# EAGLE schematic nest_interface_a (EAGLE 6.3)
ahh
REV: A; TITLE: Nest Interface Board

## Sheet 1 of 8
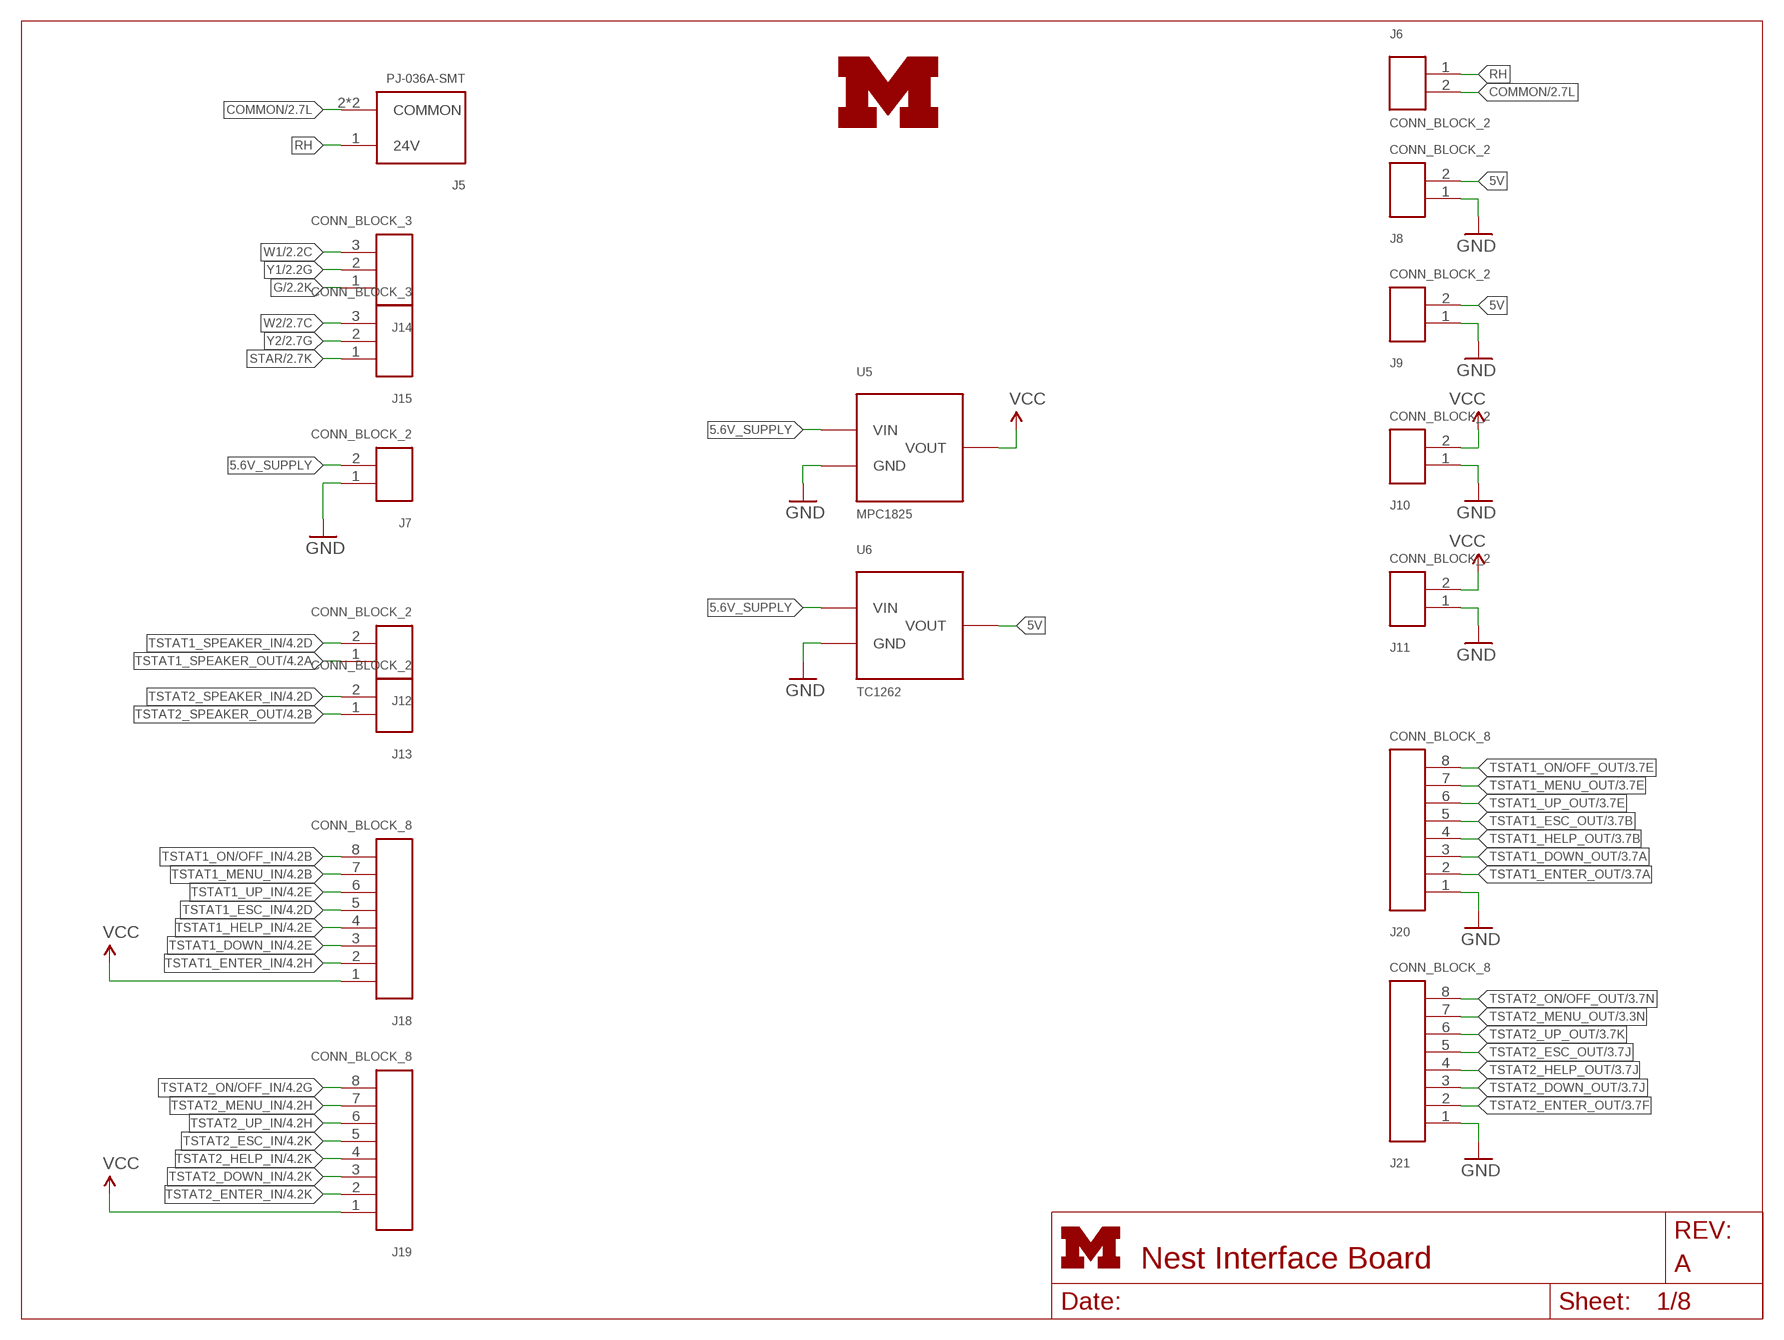
[diagram p0: schematic, sheet 1]

### Parts
J5  PJ-036A-SMT  [PJ-0361-SMT]
J6  CONN_BLOCK_2  [CONN_BLOCK_2]
J7  CONN_BLOCK_2  [CONN_BLOCK_2]
J8  CONN_BLOCK_2  [CONN_BLOCK_2]
J9  CONN_BLOCK_2  [CONN_BLOCK_2]
J10  CONN_BLOCK_2  [CONN_BLOCK_2]
J11  CONN_BLOCK_2  [CONN_BLOCK_2]
J12  CONN_BLOCK_2  [CONN_BLOCK_2]
J13  CONN_BLOCK_2  [CONN_BLOCK_2]
J14  CONN_BLOCK_3  [CONN_BLOCK_3]
J15  CONN_BLOCK_3  [CONN_BLOCK_3]
J18  CONN_BLOCK_8  [CONN_BLOCK_8]
J19  CONN_BLOCK_8  [CONN_BLOCK_8]
J20  CONN_BLOCK_8  [CONN_BLOCK_8]
J21  CONN_BLOCK_8  [CONN_BLOCK_8]
U5  MPC1825  [SOT-223-3]
U6  TC1262  [SOT-223-3]
U$1  UMICH_SOLID_LARGE  [UMICH_SOLID_350MIL]

### Nets
5.6V_SUPPLY: J7.2 U5.1(VIN) U6.1(VIN)
5V: J8.2 J9.2 U6.3(VOUT)
COMMON: J5.2(COMMON) J5.3(COMMON) J6.2 ; also sheet 2
G: J14.1 ; also sheet 2
GND: J7.1 J8.1 J9.1 J10.1 J11.1 J20.1 J21.1 U5.2(GND) U5.4(GND) U6.2(GND) U6.4(GND) ; also sheet 2,3,4,5,6,7,8
RH: J5.1(24V) J6.1
STAR: J15.1 ; also sheet 2
TSTAT1_DOWN_IN: J18.3 ; also sheet 4,6
TSTAT1_DOWN_OUT: J20.3 ; also sheet 3
TSTAT1_ENTER_IN: J18.2 ; also sheet 4,6
TSTAT1_ENTER_OUT: J20.2 ; also sheet 3
TSTAT1_ESC_IN: J18.5 ; also sheet 4,6
TSTAT1_ESC_OUT: J20.5 ; also sheet 3
TSTAT1_HELP_IN: J18.4 ; also sheet 4,6
TSTAT1_HELP_OUT: J20.4 ; also sheet 3
TSTAT1_MENU_IN: J18.7 ; also sheet 4,6
TSTAT1_MENU_OUT: J20.7 ; also sheet 3
TSTAT1_ON/OFF_IN: J18.8 ; also sheet 4,6
TSTAT1_ON/OFF_OUT: J20.8 ; also sheet 3
TSTAT1_SPEAKER_IN: J12.2 ; also sheet 4
TSTAT1_SPEAKER_OUT: J12.1 ; also sheet 4
TSTAT1_UP_IN: J18.6 ; also sheet 4,6
TSTAT1_UP_OUT: J20.6 ; also sheet 3
TSTAT2_DOWN_IN: J19.3 ; also sheet 4,6
TSTAT2_DOWN_OUT: J21.3 ; also sheet 3
TSTAT2_ENTER_IN: J19.2 ; also sheet 4,6
TSTAT2_ENTER_OUT: J21.2 ; also sheet 3
TSTAT2_ESC_IN: J19.5 ; also sheet 4,6
TSTAT2_ESC_OUT: J21.5 ; also sheet 3
TSTAT2_HELP_IN: J19.4 ; also sheet 4,6
TSTAT2_HELP_OUT: J21.4 ; also sheet 3
TSTAT2_MENU_IN: J19.7 ; also sheet 4,6
TSTAT2_MENU_OUT: J21.7 ; also sheet 3
TSTAT2_ON/OFF_IN: J19.8 ; also sheet 4,6
TSTAT2_ON/OFF_OUT: J21.8 ; also sheet 3
TSTAT2_SPEAKER_IN: J13.2 ; also sheet 4
TSTAT2_SPEAKER_OUT: J13.1 ; also sheet 4
TSTAT2_UP_IN: J19.6 ; also sheet 4,6
TSTAT2_UP_OUT: J21.6 ; also sheet 3
VCC: J10.2 J11.2 J18.1 J19.1 U5.3(VOUT) ; also sheet 2,4,5,6,7
W1: J14.3 ; also sheet 2
W2: J15.3 ; also sheet 2
Y1: J14.2 ; also sheet 2
Y2: J15.2 ; also sheet 2

## Sheet 2 of 8: Relays
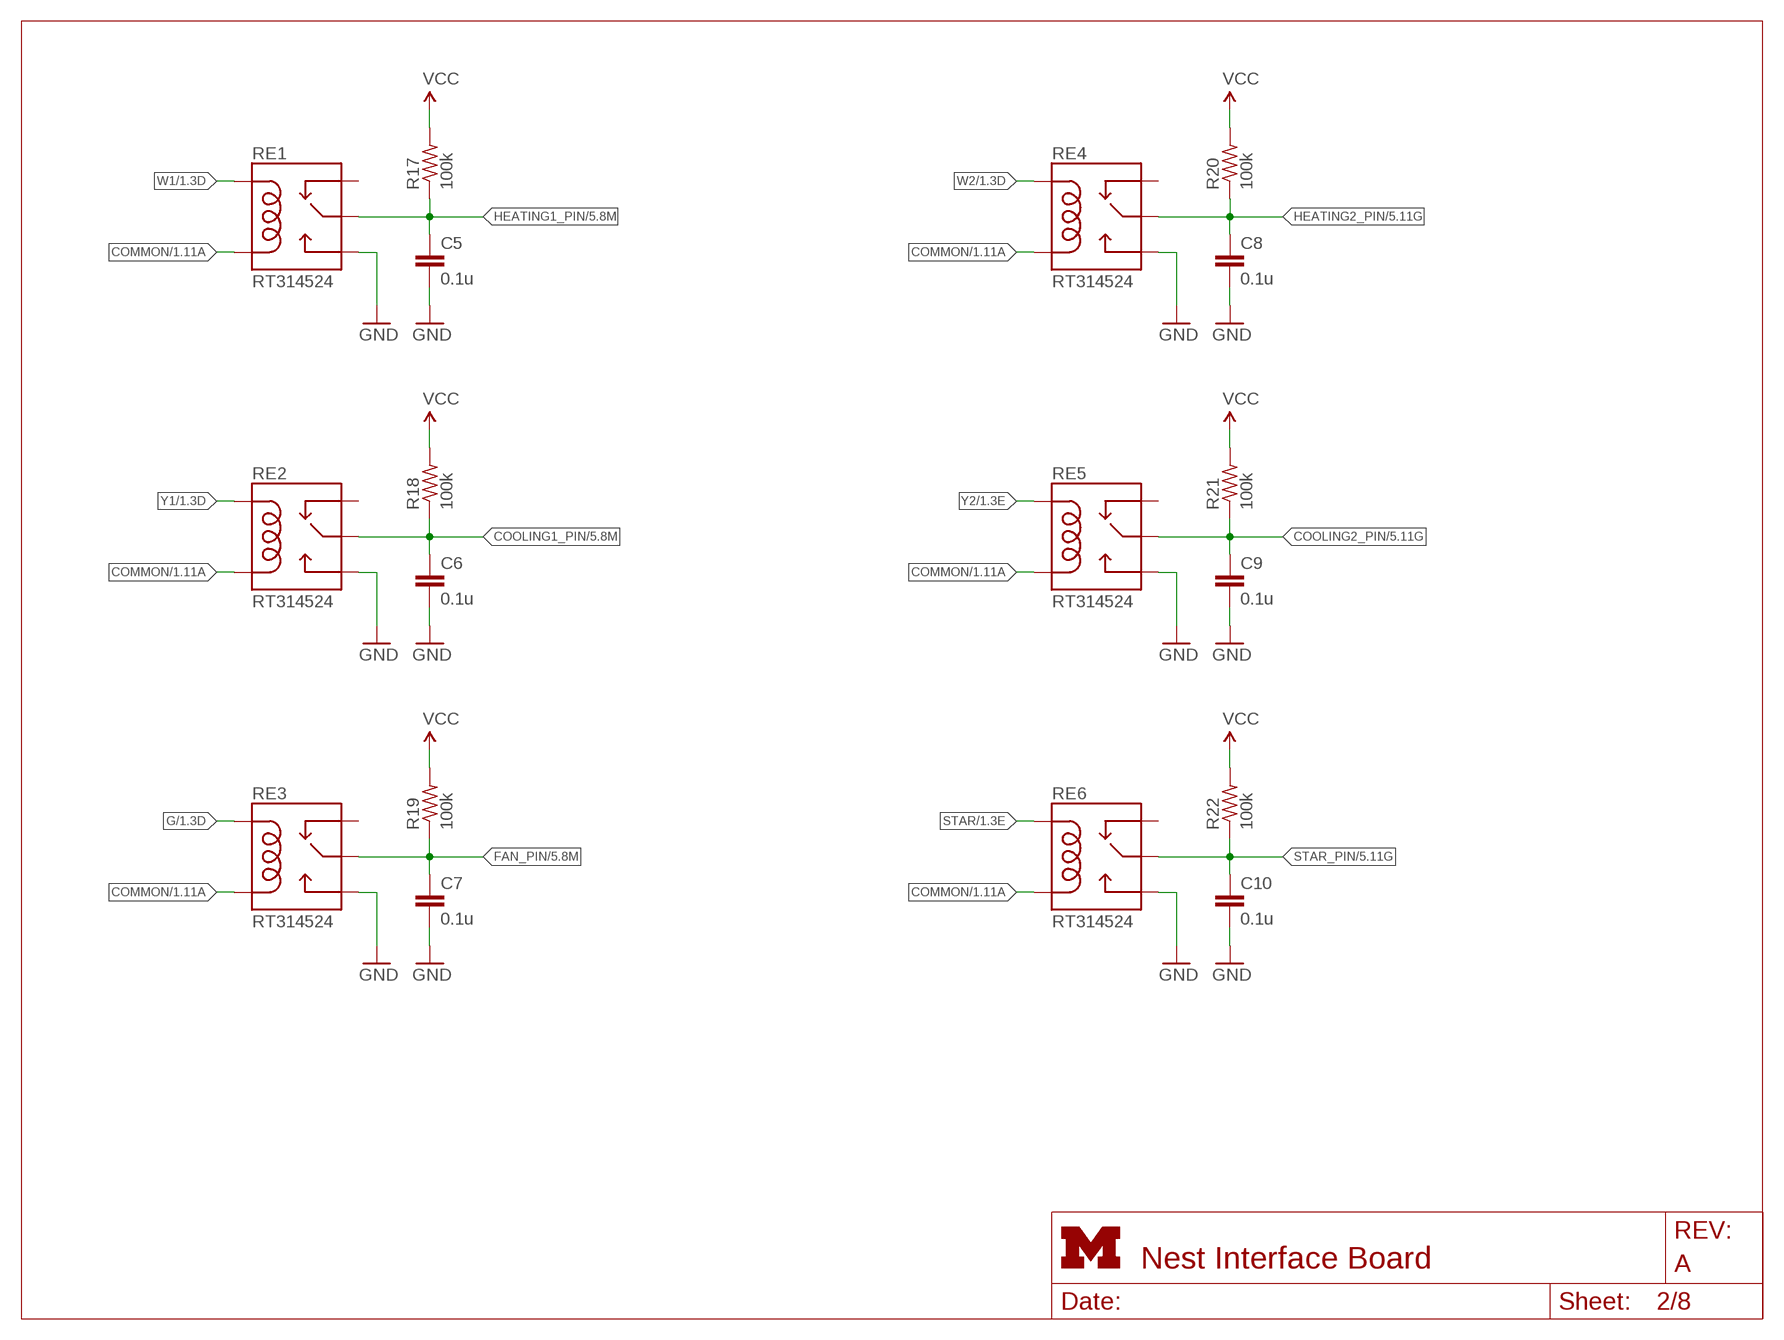
[diagram p1: schematic, sheet 2]

### Parts
C5  0.1u  C-EUC0603  [C0603]
C6  0.1u  C-EUC0603  [C0603]
C7  0.1u  C-EUC0603  [C0603]
C8  0.1u  C-EUC0603  [C0603]
C9  0.1u  C-EUC0603  [C0603]
C10  0.1u  C-EUC0603  [C0603]
R17  100k  R-US_R0603  [R0603]
R18  100k  R-US_R0603  [R0603]
R19  100k  R-US_R0603  [R0603]
R20  100k  R-US_R0603  [R0603]
R21  100k  R-US_R0603  [R0603]
R22  100k  R-US_R0603  [R0603]
RE1  RT314524  [S0418-CA]
RE2  RT314524  [S0418-CA]
RE3  RT314524  [S0418-CA]
RE4  RT314524  [S0418-CA]
RE5  RT314524  [S0418-CA]
RE6  RT314524  [S0418-CA]

### Nets
COMMON: RE1.A2(COIL2) RE2.A2(COIL2) RE3.A2(COIL2) RE4.A2(COIL2) RE5.A2(COIL2) RE6.A2(COIL2) ; also sheet 1
COOLING1_PIN: C6.1 R18.1 RE2.COMMON1(MAIN) RE2.COMMON2(MAIN) ; also sheet 5
COOLING2_PIN: C9.1 R21.1 RE5.COMMON1(MAIN) RE5.COMMON2(MAIN) ; also sheet 5
FAN_PIN: C7.1 R19.1 RE3.COMMON1(MAIN) RE3.COMMON2(MAIN) ; also sheet 5
G: RE3.A1(COIL1) ; also sheet 1
GND: C5.2 C6.2 C7.2 C8.2 C9.2 C10.2 RE1.NO1(NO) RE1.NO2(NO) RE2.NO1(NO) RE2.NO2(NO) RE3.NO1(NO) RE3.NO2(NO) RE4.NO1(NO) RE4.NO2(NO) RE5.NO1(NO) RE5.NO2(NO) RE6.NO1(NO) RE6.NO2(NO) ; also sheet 1,3,4,5,6,7,8
HEATING1_PIN: C5.1 R17.1 RE1.COMMON1(MAIN) RE1.COMMON2(MAIN) ; also sheet 5
HEATING2_PIN: C8.1 R20.1 RE4.COMMON1(MAIN) RE4.COMMON2(MAIN) ; also sheet 5
STAR: RE6.A1(COIL1) ; also sheet 1
STAR_PIN: C10.1 R22.1 RE6.COMMON1(MAIN) RE6.COMMON2(MAIN) ; also sheet 5
VCC: R17.2 R18.2 R19.2 R20.2 R21.2 R22.2 ; also sheet 1,4,5,6,7
W1: RE1.A1(COIL1) ; also sheet 1
W2: RE4.A1(COIL1) ; also sheet 1
Y1: RE2.A1(COIL1) ; also sheet 1
Y2: RE5.A1(COIL1) ; also sheet 1
Unconnected: RE1.NC1(NC) RE1.NC2(NC) RE2.NC1(NC) RE2.NC2(NC) RE3.NC1(NC) RE3.NC2(NC) RE4.NC1(NC) RE4.NC2(NC) RE5.NC1(NC) RE5.NC2(NC) RE6.NC1(NC) RE6.NC2(NC)

## Sheet 3 of 8: Wire interfacing
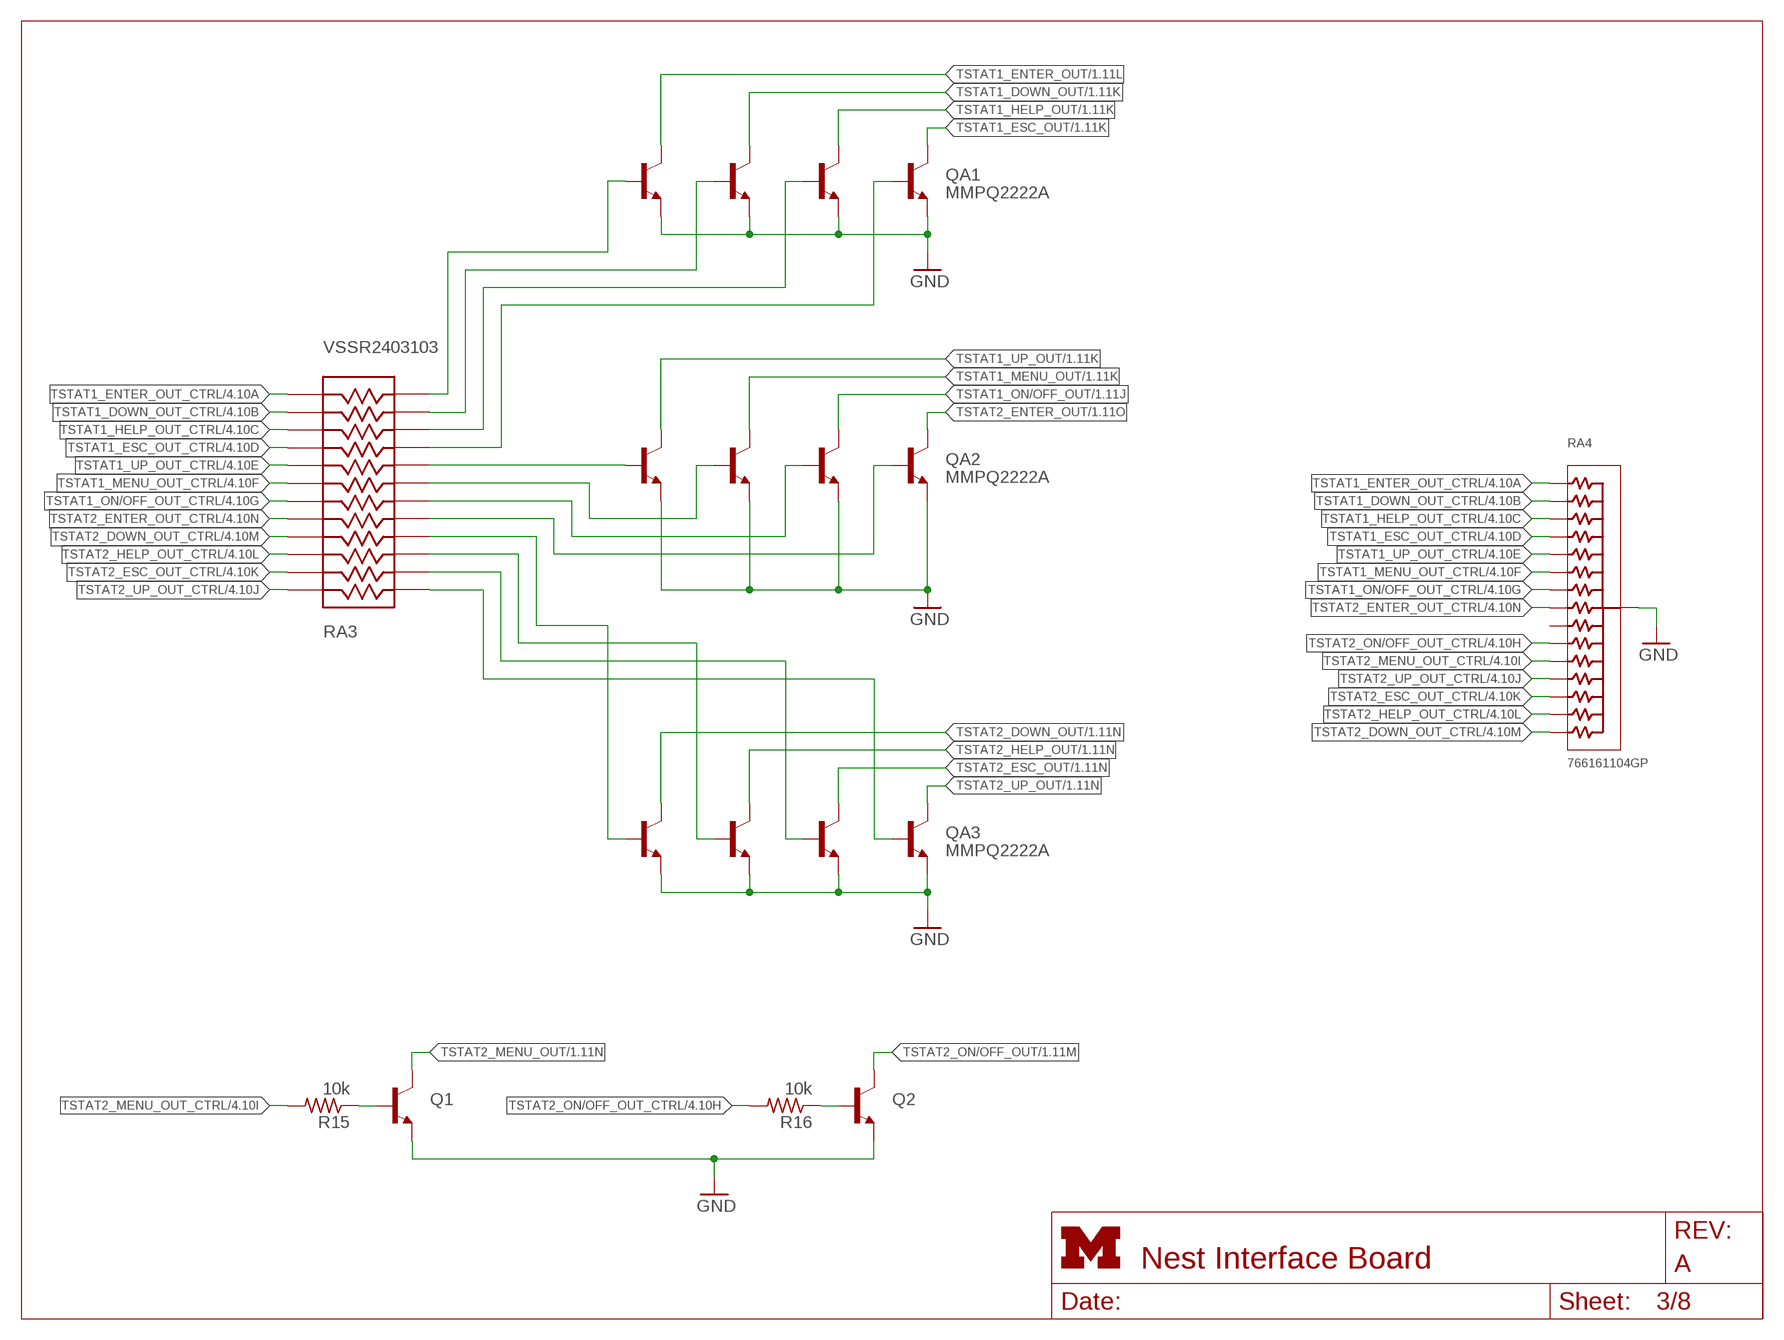
[diagram p2: schematic, sheet 3]

### Parts
Q1  TRANSISTOR_NPNSOT23  [SOT23]
Q2  TRANSISTOR_NPNSOT23  [SOT23]
QA1  MMPQ2222A  [SOIC-16]
QA2  MMPQ2222A  [SOIC-16]
QA3  MMPQ2222A  [SOIC-16]
R15  10k  R-US_R0603  [R0603]
R16  10k  R-US_R0603  [R0603]
RA3  VSSR2403103  [LSSOP-24]
RA4  766161104GP  [SOIC-16]

### Nets
GND: Q1.2(E) Q2.2(E) QA1.10(E4) QA1.12(E3) QA1.14(E2) QA1.16(E1) QA2.10(E4) QA2.12(E3) QA2.14(E2) QA2.16(E1) QA3.10(E4) QA3.12(E3) QA3.14(E2) QA3.16(E1) RA4.16(OUT) ; also sheet 1,2,4,5,6,7,8
N$16: QA2.11(B3) RA3.19
N$17: QA1.13(B2) RA3.14
N$25: QA1.11(B3) RA3.15
N$26: QA1.9(B4) RA3.16
N$27: QA3.9(B4) RA3.24
N$28: QA3.15(B1) RA3.21
N$29: QA3.13(B2) RA3.22
N$30: QA3.11(B3) RA3.23
N$31: Q1.1(B) R15.1
N$32: Q2.1(B) R16.1
N$33: QA1.15(B1) RA3.13
N$34: QA2.15(B1) RA3.17
N$37: QA2.9(B4) RA3.20
N$58: QA2.13(B2) RA3.18
TSTAT1_DOWN_OUT: QA1.3(C2) QA1.4(C2) ; also sheet 1
TSTAT1_DOWN_OUT_CTRL: RA3.11 RA4.2 ; also sheet 4
TSTAT1_ENTER_OUT: QA1.1(C1) QA1.2(C1) ; also sheet 1
TSTAT1_ENTER_OUT_CTRL: RA3.12 RA4.1 ; also sheet 4
TSTAT1_ESC_OUT: QA1.7(C4) QA1.8(C4) ; also sheet 1
TSTAT1_ESC_OUT_CTRL: RA3.9 RA4.4 ; also sheet 4
TSTAT1_HELP_OUT: QA1.5(C3) QA1.6(C3) ; also sheet 1
TSTAT1_HELP_OUT_CTRL: RA3.10 RA4.3 ; also sheet 4
TSTAT1_MENU_OUT: QA2.3(C2) QA2.4(C2) ; also sheet 1
TSTAT1_MENU_OUT_CTRL: RA3.7 RA4.6 ; also sheet 4
TSTAT1_ON/OFF_OUT: QA2.5(C3) QA2.6(C3) ; also sheet 1
TSTAT1_ON/OFF_OUT_CTRL: RA3.6 RA4.7 ; also sheet 4
TSTAT1_UP_OUT: QA2.1(C1) QA2.2(C1) ; also sheet 1
TSTAT1_UP_OUT_CTRL: RA3.8 RA4.5 ; also sheet 4
TSTAT2_DOWN_OUT: QA3.1(C1) QA3.2(C1) ; also sheet 1
TSTAT2_DOWN_OUT_CTRL: RA3.4 RA4.15 ; also sheet 4
TSTAT2_ENTER_OUT: QA2.7(C4) QA2.8(C4) ; also sheet 1
TSTAT2_ENTER_OUT_CTRL: RA3.5 RA4.8 ; also sheet 4
TSTAT2_ESC_OUT: QA3.5(C3) QA3.6(C3) ; also sheet 1
TSTAT2_ESC_OUT_CTRL: RA3.2 RA4.13 ; also sheet 4
TSTAT2_HELP_OUT: QA3.3(C2) QA3.4(C2) ; also sheet 1
TSTAT2_HELP_OUT_CTRL: RA3.3 RA4.14 ; also sheet 4
TSTAT2_MENU_OUT: Q1.3(C) ; also sheet 1
TSTAT2_MENU_OUT_CTRL: R15.2 RA4.11 ; also sheet 4
TSTAT2_ON/OFF_OUT: Q2.3(C) ; also sheet 1
TSTAT2_ON/OFF_OUT_CTRL: R16.2 RA4.10 ; also sheet 4
TSTAT2_UP_OUT: QA3.7(C4) QA3.8(C4) ; also sheet 1
TSTAT2_UP_OUT_CTRL: RA3.1 RA4.12 ; also sheet 4
Unconnected: RA4.9

## Sheet 4 of 8: Input buttons from thermostat
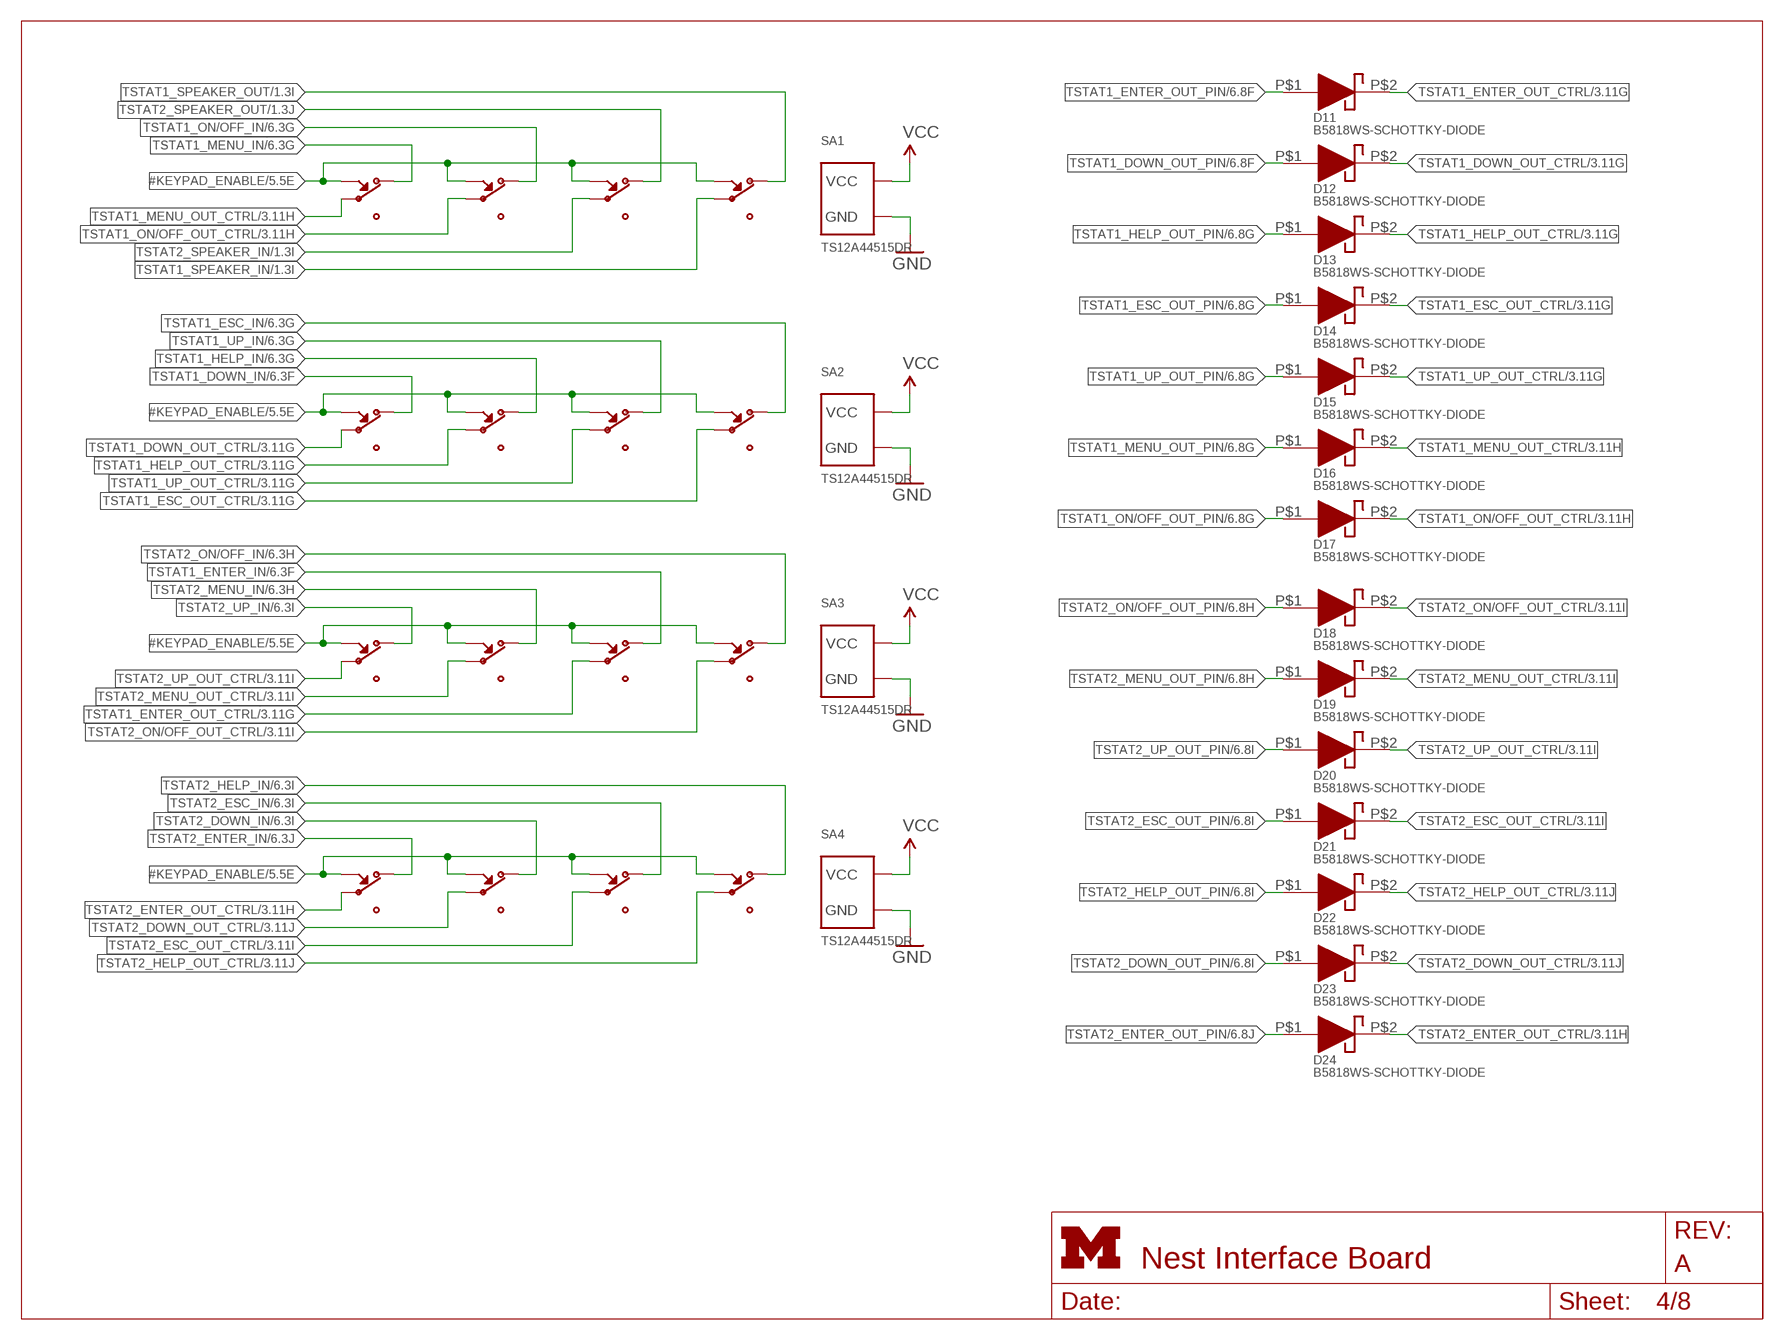
[diagram p3: schematic, sheet 4]

### Parts
D11  B5818WS-SCHOTTKY-DIODE  [SOD-323]
D12  B5818WS-SCHOTTKY-DIODE  [SOD-323]
D13  B5818WS-SCHOTTKY-DIODE  [SOD-323]
D14  B5818WS-SCHOTTKY-DIODE  [SOD-323]
D15  B5818WS-SCHOTTKY-DIODE  [SOD-323]
D16  B5818WS-SCHOTTKY-DIODE  [SOD-323]
D17  B5818WS-SCHOTTKY-DIODE  [SOD-323]
D18  B5818WS-SCHOTTKY-DIODE  [SOD-323]
D19  B5818WS-SCHOTTKY-DIODE  [SOD-323]
D20  B5818WS-SCHOTTKY-DIODE  [SOD-323]
D21  B5818WS-SCHOTTKY-DIODE  [SOD-323]
D22  B5818WS-SCHOTTKY-DIODE  [SOD-323]
D23  B5818WS-SCHOTTKY-DIODE  [SOD-323]
D24  B5818WS-SCHOTTKY-DIODE  [SOD-323]
SA1  TS12A44515DR  [SOIC-14]
SA2  TS12A44515DR  [SOIC-14]
SA3  TS12A44515DR  [SOIC-14]
SA4  TS12A44515DR  [SOIC-14]

### Nets
#KEYPAD_ENABLE: SA1.5(IN2) SA1.6(IN3) SA1.12(IN4) SA1.13(IN1) SA2.5(IN2) SA2.6(IN3) SA2.12(IN4) SA2.13(IN1) SA3.5(IN2) SA3.6(IN3) SA3.12(IN4) SA3.13(IN1) SA4.5(IN2) SA4.6(IN3) SA4.12(IN4) SA4.13(IN1) ; also sheet 5
GND: SA1.7(GND) SA2.7(GND) SA3.7(GND) SA4.7(GND) ; also sheet 1,2,3,5,6,7,8
TSTAT1_DOWN_IN: SA2.1(NC1) ; also sheet 1,6
TSTAT1_DOWN_OUT_CTRL: D12.P$2(C) SA2.2(COM1) ; also sheet 3
TSTAT1_DOWN_OUT_PIN: D12.P$1(A) ; also sheet 6
TSTAT1_ENTER_IN: SA3.8(NC3) ; also sheet 1,6
TSTAT1_ENTER_OUT_CTRL: D11.P$2(C) SA3.9(COM3) ; also sheet 3
TSTAT1_ENTER_OUT_PIN: D11.P$1(A) ; also sheet 6
TSTAT1_ESC_IN: SA2.11(NC4) ; also sheet 1,6
TSTAT1_ESC_OUT_CTRL: D14.P$2(C) SA2.10(COM4) ; also sheet 3
TSTAT1_ESC_OUT_PIN: D14.P$1(A) ; also sheet 6
TSTAT1_HELP_IN: SA2.3(NC2) ; also sheet 1,6
TSTAT1_HELP_OUT_CTRL: D13.P$2(C) SA2.4(COM2) ; also sheet 3
TSTAT1_HELP_OUT_PIN: D13.P$1(A) ; also sheet 6
TSTAT1_MENU_IN: SA1.1(NC1) ; also sheet 1,6
TSTAT1_MENU_OUT_CTRL: D16.P$2(C) SA1.2(COM1) ; also sheet 3
TSTAT1_MENU_OUT_PIN: D16.P$1(A) ; also sheet 6
TSTAT1_ON/OFF_IN: SA1.3(NC2) ; also sheet 1,6
TSTAT1_ON/OFF_OUT_CTRL: D17.P$2(C) SA1.4(COM2) ; also sheet 3
TSTAT1_ON/OFF_OUT_PIN: D17.P$1(A) ; also sheet 6
TSTAT1_SPEAKER_IN: SA1.10(COM4) ; also sheet 1
TSTAT1_SPEAKER_OUT: SA1.11(NC4) ; also sheet 1
TSTAT1_UP_IN: SA2.8(NC3) ; also sheet 1,6
TSTAT1_UP_OUT_CTRL: D15.P$2(C) SA2.9(COM3) ; also sheet 3
TSTAT1_UP_OUT_PIN: D15.P$1(A) ; also sheet 6
TSTAT2_DOWN_IN: SA4.3(NC2) ; also sheet 1,6
TSTAT2_DOWN_OUT_CTRL: D23.P$2(C) SA4.4(COM2) ; also sheet 3
TSTAT2_DOWN_OUT_PIN: D23.P$1(A) ; also sheet 6
TSTAT2_ENTER_IN: SA4.1(NC1) ; also sheet 1,6
TSTAT2_ENTER_OUT_CTRL: D24.P$2(C) SA4.2(COM1) ; also sheet 3
TSTAT2_ENTER_OUT_PIN: D24.P$1(A) ; also sheet 6
TSTAT2_ESC_IN: SA4.8(NC3) ; also sheet 1,6
TSTAT2_ESC_OUT_CTRL: D21.P$2(C) SA4.9(COM3) ; also sheet 3
TSTAT2_ESC_OUT_PIN: D21.P$1(A) ; also sheet 6
TSTAT2_HELP_IN: SA4.11(NC4) ; also sheet 1,6
TSTAT2_HELP_OUT_CTRL: D22.P$2(C) SA4.10(COM4) ; also sheet 3
TSTAT2_HELP_OUT_PIN: D22.P$1(A) ; also sheet 6
TSTAT2_MENU_IN: SA3.3(NC2) ; also sheet 1,6
TSTAT2_MENU_OUT_CTRL: D19.P$2(C) SA3.4(COM2) ; also sheet 3
TSTAT2_MENU_OUT_PIN: D19.P$1(A) ; also sheet 6
TSTAT2_ON/OFF_IN: SA3.11(NC4) ; also sheet 1,6
TSTAT2_ON/OFF_OUT_CTRL: D18.P$2(C) SA3.10(COM4) ; also sheet 3
TSTAT2_ON/OFF_OUT_PIN: D18.P$1(A) ; also sheet 6
TSTAT2_SPEAKER_IN: SA1.9(COM3) ; also sheet 1
TSTAT2_SPEAKER_OUT: SA1.8(NC3) ; also sheet 1
TSTAT2_UP_IN: SA3.1(NC1) ; also sheet 1,6
TSTAT2_UP_OUT_CTRL: D20.P$2(C) SA3.2(COM1) ; also sheet 3
TSTAT2_UP_OUT_PIN: D20.P$1(A) ; also sheet 6
VCC: SA1.14(VCC) SA2.14(VCC) SA3.14(VCC) SA4.14(VCC) ; also sheet 1,2,5,6,7

## Sheet 5 of 8: EPIC and programming circuit
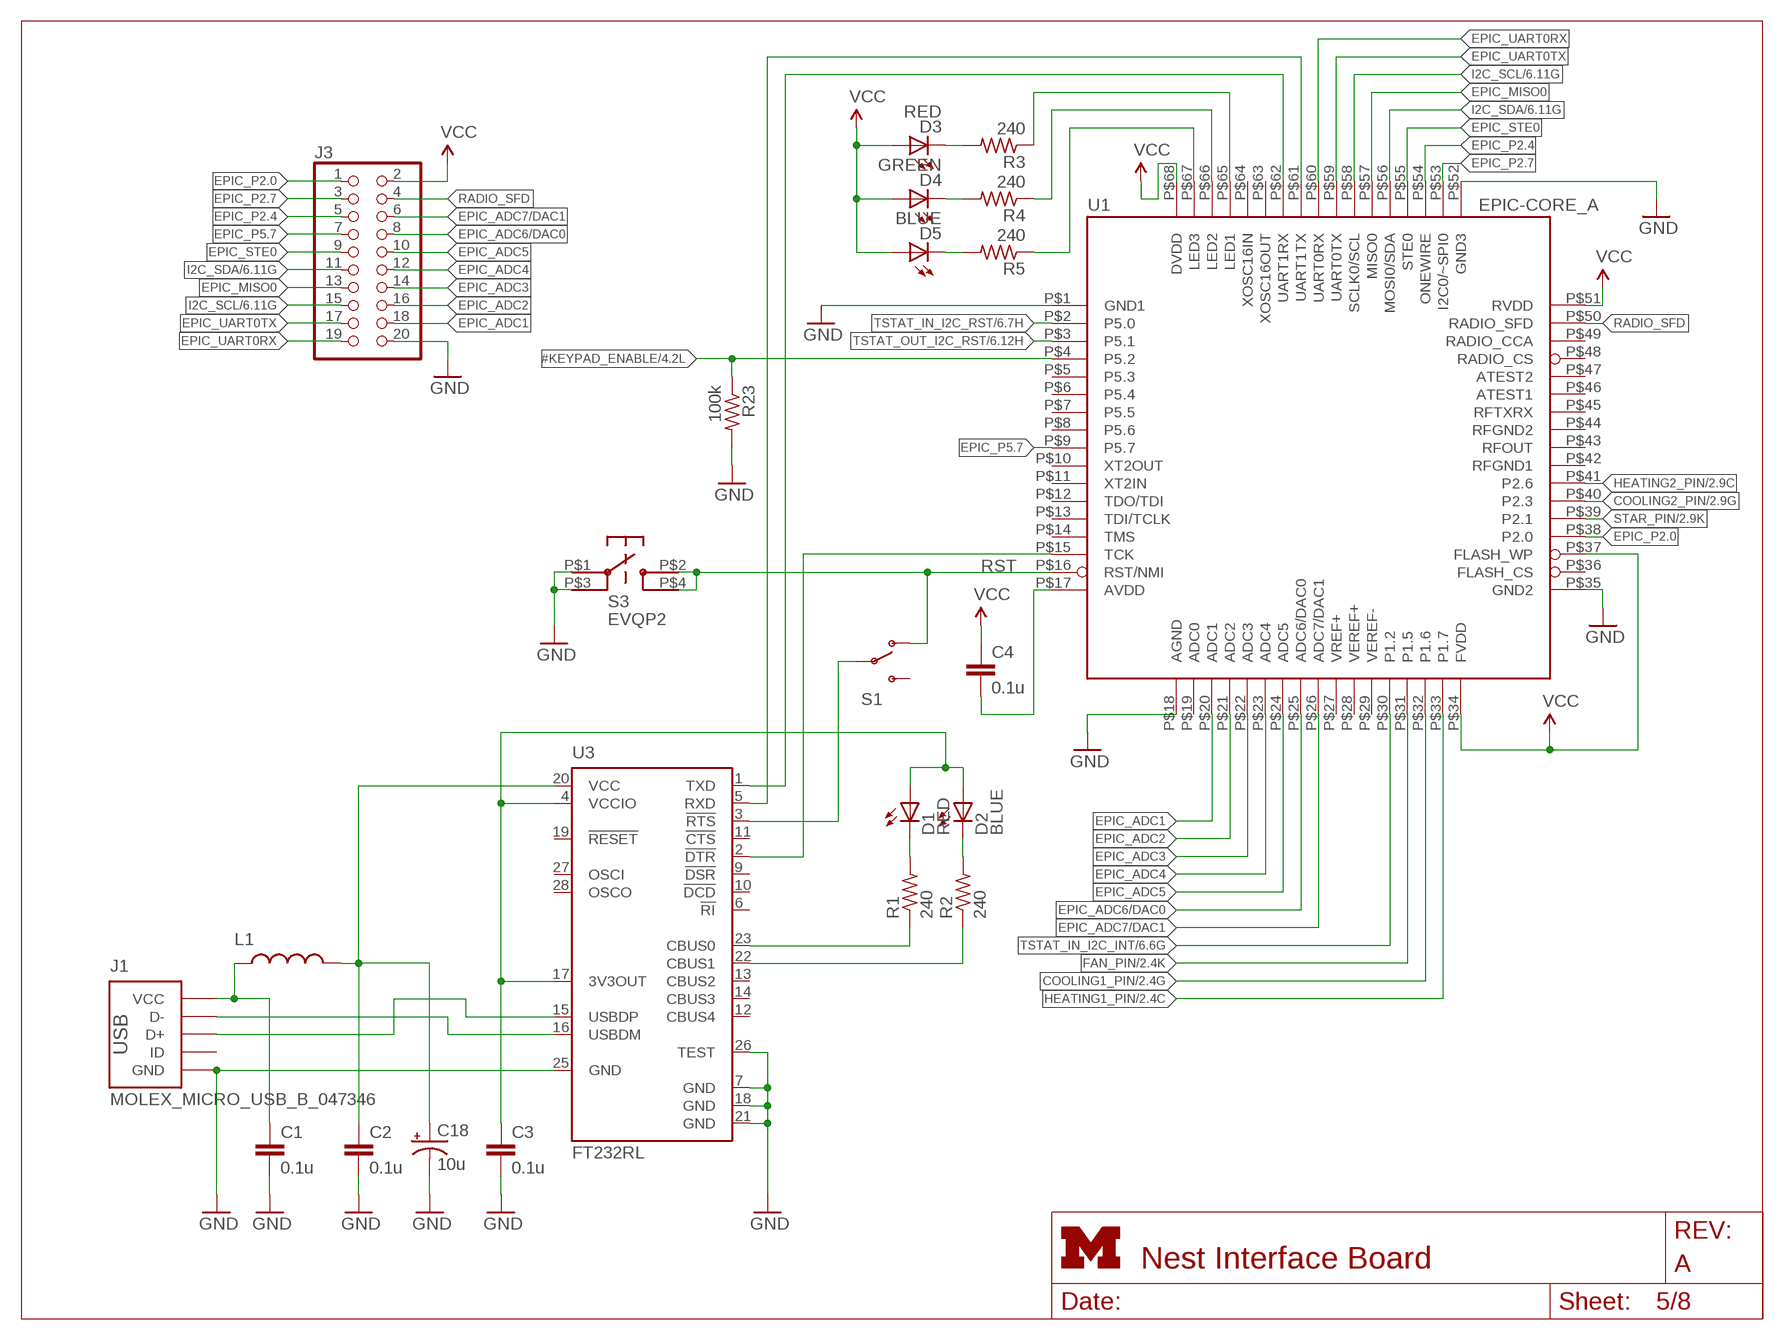
[diagram p4: schematic, sheet 5]

### Parts
C1  0.1u  C-EUC0603  [C0603]
C2  0.1u  C-EUC0603  [C0603]
C3  0.1u  C-EUC0603  [C0603]
C4  0.1u  C-EUC0603  [C0603]
C18  10u  CAP_POL1206  [EIA3216]
D1  RED  LED0603  [LED-0603]
D2  BLUE  LED0603  [LED-0603]
D3  RED  LED0603  [LED-0603]
D4  GREEN  LED0603  [LED-0603]
D5  BLUE  LED0603  [LED-0603]
J1  MOLEX_MICRO_USB_B_047346  [MOLEX_MICRO_USB_B_047346]
J3  PINHD-2X10  [2X10]
L1  INDUCTOR0603  [0603]
R1  240  R-US_R0603  [R0603]
R2  240  R-US_R0603  [R0603]
R3  240  R-US_R0603  [R0603]
R4  240  R-US_R0603  [R0603]
R5  240  R-US_R0603  [R0603]
R23  100k  R-US_R0603  [R0603]
S1  SWITCH-SPSTPTH  [SWITCH-SPDT]
S3  EVQP2  [EVQP2]
U1  EPIC-CORE_A  [EPIC-LCC68]
U3  FT232RL  [SSOP28]

### Nets
#KEYPAD_ENABLE: R23.1 U1.P$4(P5.2) ; also sheet 4
COOLING1_PIN: U1.P$32(P1.6) ; also sheet 2
COOLING2_PIN: U1.P$40(P2.3) ; also sheet 2
EPIC_ADC1: J3.18 U1.P$20(ADC1)
EPIC_ADC2: J3.16 U1.P$21(ADC2)
EPIC_ADC3: J3.14 U1.P$22(ADC3)
EPIC_ADC4: J3.12 U1.P$23(ADC4)
EPIC_ADC5: J3.10 U1.P$24(ADC5)
EPIC_ADC6/DAC0: J3.8 U1.P$25(ADC6/DAC0)
EPIC_ADC7/DAC1: J3.6 U1.P$26(ADC7/DAC1)
EPIC_MISO0: J3.13 U1.P$57(MISO0)
EPIC_P2.0: J3.1 U1.P$38(P2.0)
EPIC_P2.4: J3.5 U1.P$54(ONEWIRE)
EPIC_P2.7: J3.3 U1.P$53(I2C0/~SPI0)
EPIC_P5.7: J3.7 U1.P$9(P5.7)
EPIC_STE0: J3.9 U1.P$55(STE0)
EPIC_UART0RX: J3.19 U1.P$60(UART0RX)
EPIC_UART0TX: J3.17 U1.P$59(UART0TX)
FAN_PIN: U1.P$31(P1.5) ; also sheet 2
GND: C1.2 C2.2 C3.2 C18.C(-) J1.GND J3.20 R23.2 S3.P$1 S3.P$3 U1.P$1(GND1) U1.P$18(AGND) U1.P$35(GND2) U1.P$52(GND3) U3.7(GND) U3.18(GND) U3.21(GND) U3.25(GND) U3.26(TEST) ; also sheet 1,2,3,4,6,7,8
HEATING1_PIN: U1.P$33(P1.7) ; also sheet 2
HEATING2_PIN: U1.P$41(P2.6) ; also sheet 2
I2C_SCL: J3.15 U1.P$58(SCLK0/SCL) ; also sheet 6,7
I2C_SDA: J3.11 U1.P$56(MOSI0/SDA) ; also sheet 6,7
N$1: C1.1 J1.VCC L1.1
N$2: D1.C R1.2
N$3: J1.D- U3.16(USBDM)
N$4: J1.D+ U3.15(USBDP)
N$6: C2.1 C18.A(+) L1.2 U3.20(VCC)
N$7: D2.C R2.2
N$9: U1.P$62(UART1RX) U3.1(TXD)
N$10: R1.1 U3.23(CBUS0)
N$11: R2.1 U3.22(CBUS1)
N$12: U1.P$61(UART1TX) U3.5(RXD)
N$14: U1.P$15(TCK) U3.2(!DTR)
N$15: C3.1 D1.A D2.A U3.4(VCCIO) U3.17(3V3OUT)
N$18: C4.2 U1.P$17(AVDD)
N$19: D3.C R3.2
N$20: D4.C R4.2
N$21: D5.C R5.2
N$22: R5.1 U1.P$67(LED3)
N$23: R4.1 U1.P$66(LED2)
N$24: R3.1 U1.P$65(LED1)
RADIO_SFD: J3.4 U1.P$50(RADIO_SFD)
RST: S1.1(O) S3.P$2 S3.P$4 U1.P$16(RST/NMI)
RST_USB: S1.2(P) U3.3(!RTS)
STAR_PIN: U1.P$39(P2.1) ; also sheet 2
TSTAT_IN_I2C_INT: U1.P$30(P1.2) ; also sheet 6
TSTAT_IN_I2C_RST: U1.P$2(P5.0) ; also sheet 6
TSTAT_OUT_I2C_RST: U1.P$3(P5.1) ; also sheet 6
VCC: C4.1 D3.A D4.A D5.A J3.2 U1.P$34(FVDD) U1.P$37(FLASH_WP) U1.P$51(RVDD) U1.P$68(DVDD) ; also sheet 1,2,4,6,7
Unconnected: J1.ID S1.3(S) U1.P$5(P5.3) U1.P$6(P5.4) U1.P$7(P5.5) U1.P$8(P5.6) U1.P$10(XT2OUT) U1.P$11(XT2IN) U1.P$12(TDO/TDI) U1.P$13(TDI/TCLK) U1.P$14(TMS) U1.P$19(ADC0) U1.P$27(VREF+) U1.P$28(VEREF+) U1.P$29(VEREF-) U1.P$36(FLASH_CS) U1.P$42(RFGND1) U1.P$43(RFOUT) U1.P$44(RFGND2) U1.P$45(RFTXRX) U1.P$46(ATEST1) U1.P$47(ATEST2) U1.P$48(RADIO_CS) U1.P$49(RADIO_CCA) U1.P$63(XOSC16OUT) U1.P$64(XOSC16IN) U3.6(!RI) U3.9(!DSR) U3.10(!DCD) U3.11(!CTS) U3.12(CBUS4) U3.13(CBUS2) U3.14(CBUS3) U3.19(!RESET) U3.27(OSCI) U3.28(OSCO)

## Sheet 6 of 8: GPIO Extenders
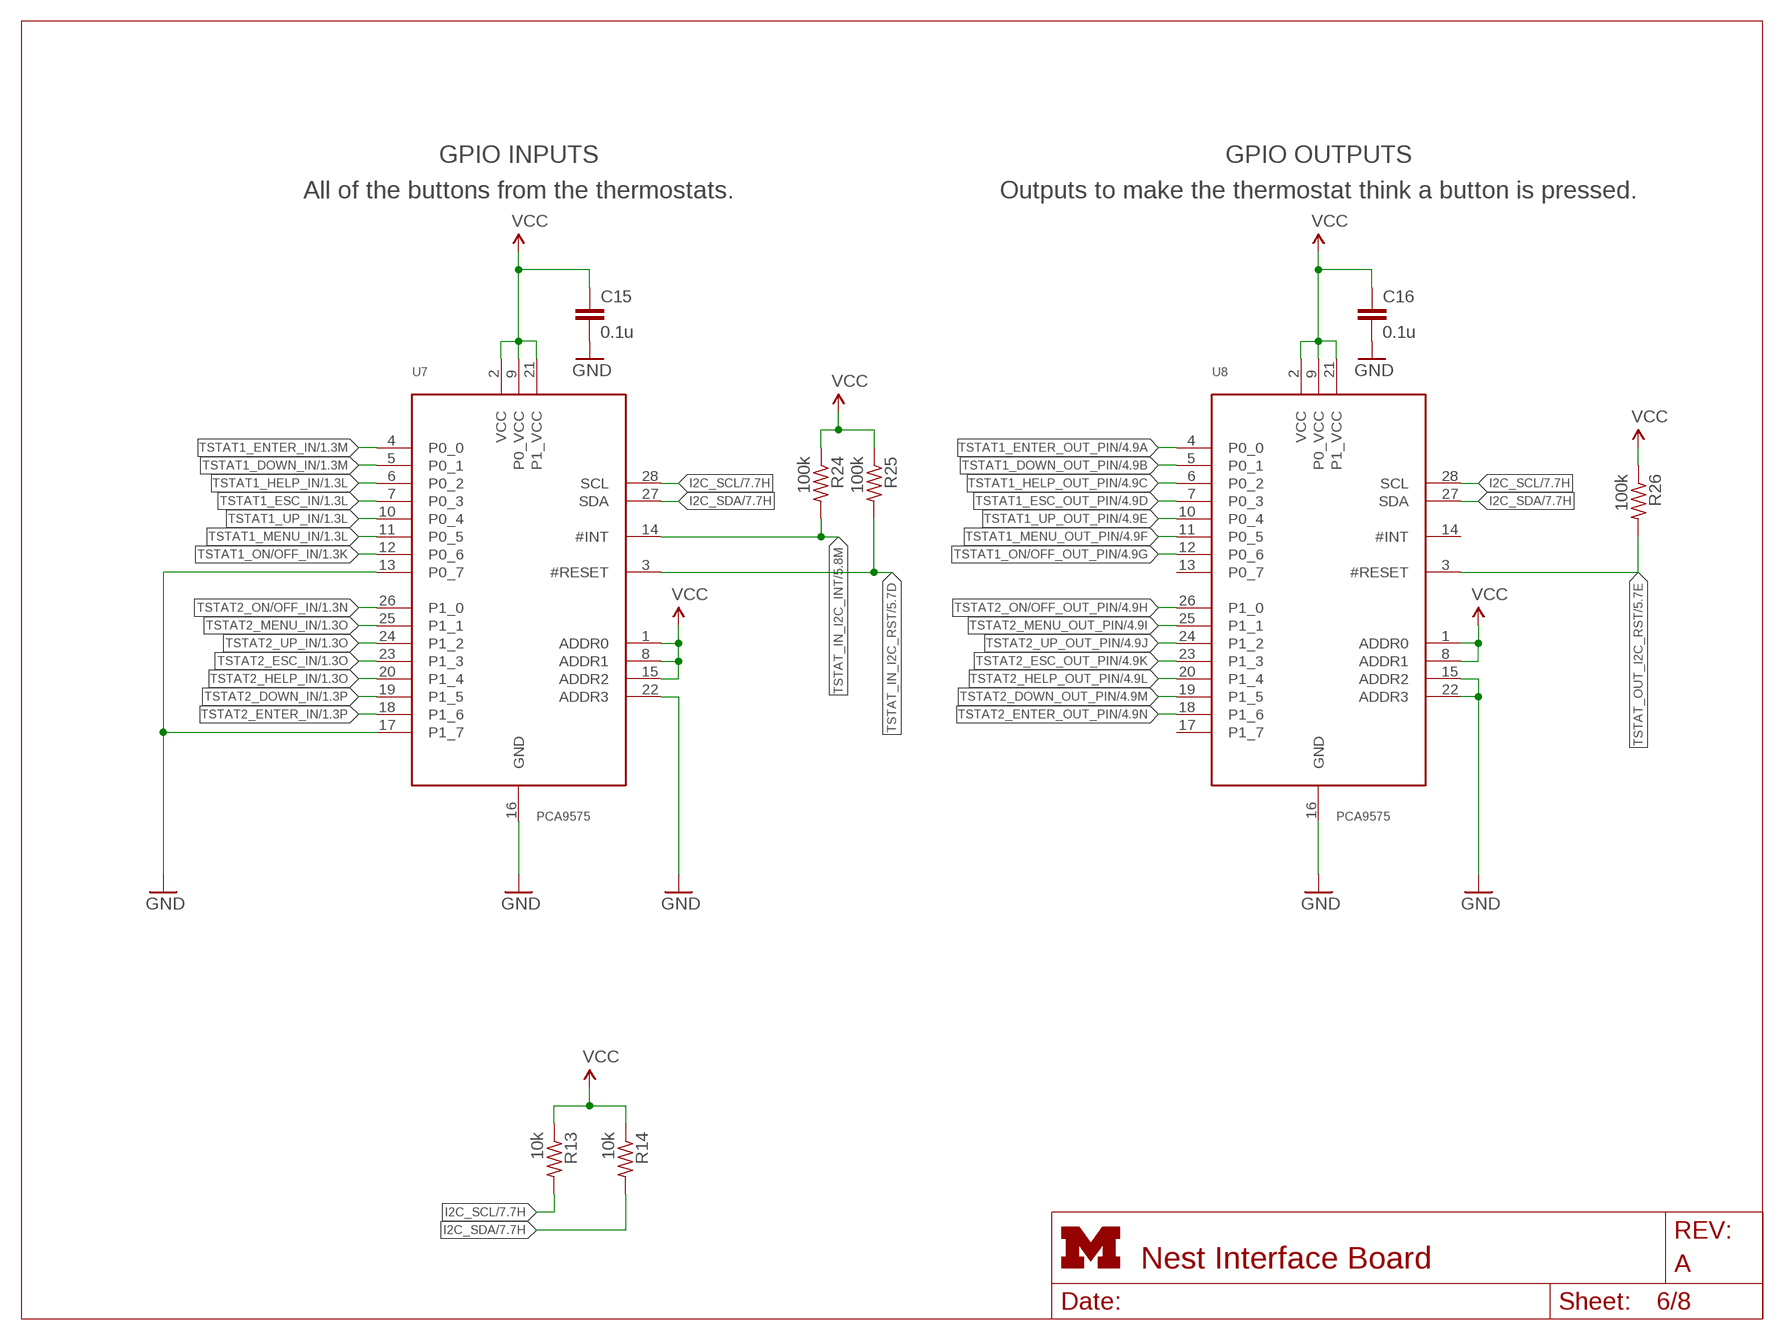
[diagram p5: schematic, sheet 6]

### Parts
C15  0.1u  C-EUC0603  [C0603]
C16  0.1u  C-EUC0603  [C0603]
R13  10k  R-US_R0603  [R0603]
R14  10k  R-US_R0603  [R0603]
R24  100k  R-US_R0603  [R0603]
R25  100k  R-US_R0603  [R0603]
R26  100k  R-US_R0603  [R0603]
U7  PCA9575  [TSSOP28]
U8  PCA9575  [TSSOP28]

### Nets
GND: C15.2 C16.2 U7.13(P0_7) U7.16(GND) U7.17(P1_7) U7.22(ADDR3) U8.15(ADDR2) U8.16(GND) U8.22(ADDR3) ; also sheet 1,2,3,4,5,7,8
I2C_SCL: R13.2 U7.28(SCL) U8.28(SCL) ; also sheet 5,7
I2C_SDA: R14.2 U7.27(SDA) U8.27(SDA) ; also sheet 5,7
TSTAT1_DOWN_IN: U7.5(P0_1) ; also sheet 1,4
TSTAT1_DOWN_OUT_PIN: U8.5(P0_1) ; also sheet 4
TSTAT1_ENTER_IN: U7.4(P0_0) ; also sheet 1,4
TSTAT1_ENTER_OUT_PIN: U8.4(P0_0) ; also sheet 4
TSTAT1_ESC_IN: U7.7(P0_3) ; also sheet 1,4
TSTAT1_ESC_OUT_PIN: U8.7(P0_3) ; also sheet 4
TSTAT1_HELP_IN: U7.6(P0_2) ; also sheet 1,4
TSTAT1_HELP_OUT_PIN: U8.6(P0_2) ; also sheet 4
TSTAT1_MENU_IN: U7.11(P0_5) ; also sheet 1,4
TSTAT1_MENU_OUT_PIN: U8.11(P0_5) ; also sheet 4
TSTAT1_ON/OFF_IN: U7.12(P0_6) ; also sheet 1,4
TSTAT1_ON/OFF_OUT_PIN: U8.12(P0_6) ; also sheet 4
TSTAT1_UP_IN: U7.10(P0_4) ; also sheet 1,4
TSTAT1_UP_OUT_PIN: U8.10(P0_4) ; also sheet 4
TSTAT2_DOWN_IN: U7.19(P1_5) ; also sheet 1,4
TSTAT2_DOWN_OUT_PIN: U8.19(P1_5) ; also sheet 4
TSTAT2_ENTER_IN: U7.18(P1_6) ; also sheet 1,4
TSTAT2_ENTER_OUT_PIN: U8.18(P1_6) ; also sheet 4
TSTAT2_ESC_IN: U7.23(P1_3) ; also sheet 1,4
TSTAT2_ESC_OUT_PIN: U8.23(P1_3) ; also sheet 4
TSTAT2_HELP_IN: U7.20(P1_4) ; also sheet 1,4
TSTAT2_HELP_OUT_PIN: U8.20(P1_4) ; also sheet 4
TSTAT2_MENU_IN: U7.25(P1_1) ; also sheet 1,4
TSTAT2_MENU_OUT_PIN: U8.25(P1_1) ; also sheet 4
TSTAT2_ON/OFF_IN: U7.26(P1_0) ; also sheet 1,4
TSTAT2_ON/OFF_OUT_PIN: U8.26(P1_0) ; also sheet 4
TSTAT2_UP_IN: U7.24(P1_2) ; also sheet 1,4
TSTAT2_UP_OUT_PIN: U8.24(P1_2) ; also sheet 4
TSTAT_IN_I2C_INT: R24.2 U7.14(#INT) ; also sheet 5
TSTAT_IN_I2C_RST: R25.2 U7.3(#RESET) ; also sheet 5
TSTAT_OUT_I2C_RST: R26.2 U8.3(#RESET) ; also sheet 5
VCC: C15.1 C16.1 R13.1 R14.1 R24.1 R25.1 R26.1 U7.1(ADDR0) U7.2(VCC) U7.8(ADDR1) U7.9(P0_VCC) U7.15(ADDR2) U7.21(P1_VCC) U8.1(ADDR0) U8.2(VCC) U8.8(ADDR1) U8.9(P0_VCC) U8.21(P1_VCC) ; also sheet 1,2,4,5,7
Unconnected: U8.13(P0_7) U8.14(#INT) U8.17(P1_7)

### Notes on the sheet
- GPIO INPUTS | GPIO OUTPUTS
- All of the buttons from the thermostats. | Outputs to make the thermostat think a button is pressed.

## Sheet 7 of 8: LCD Sniffer
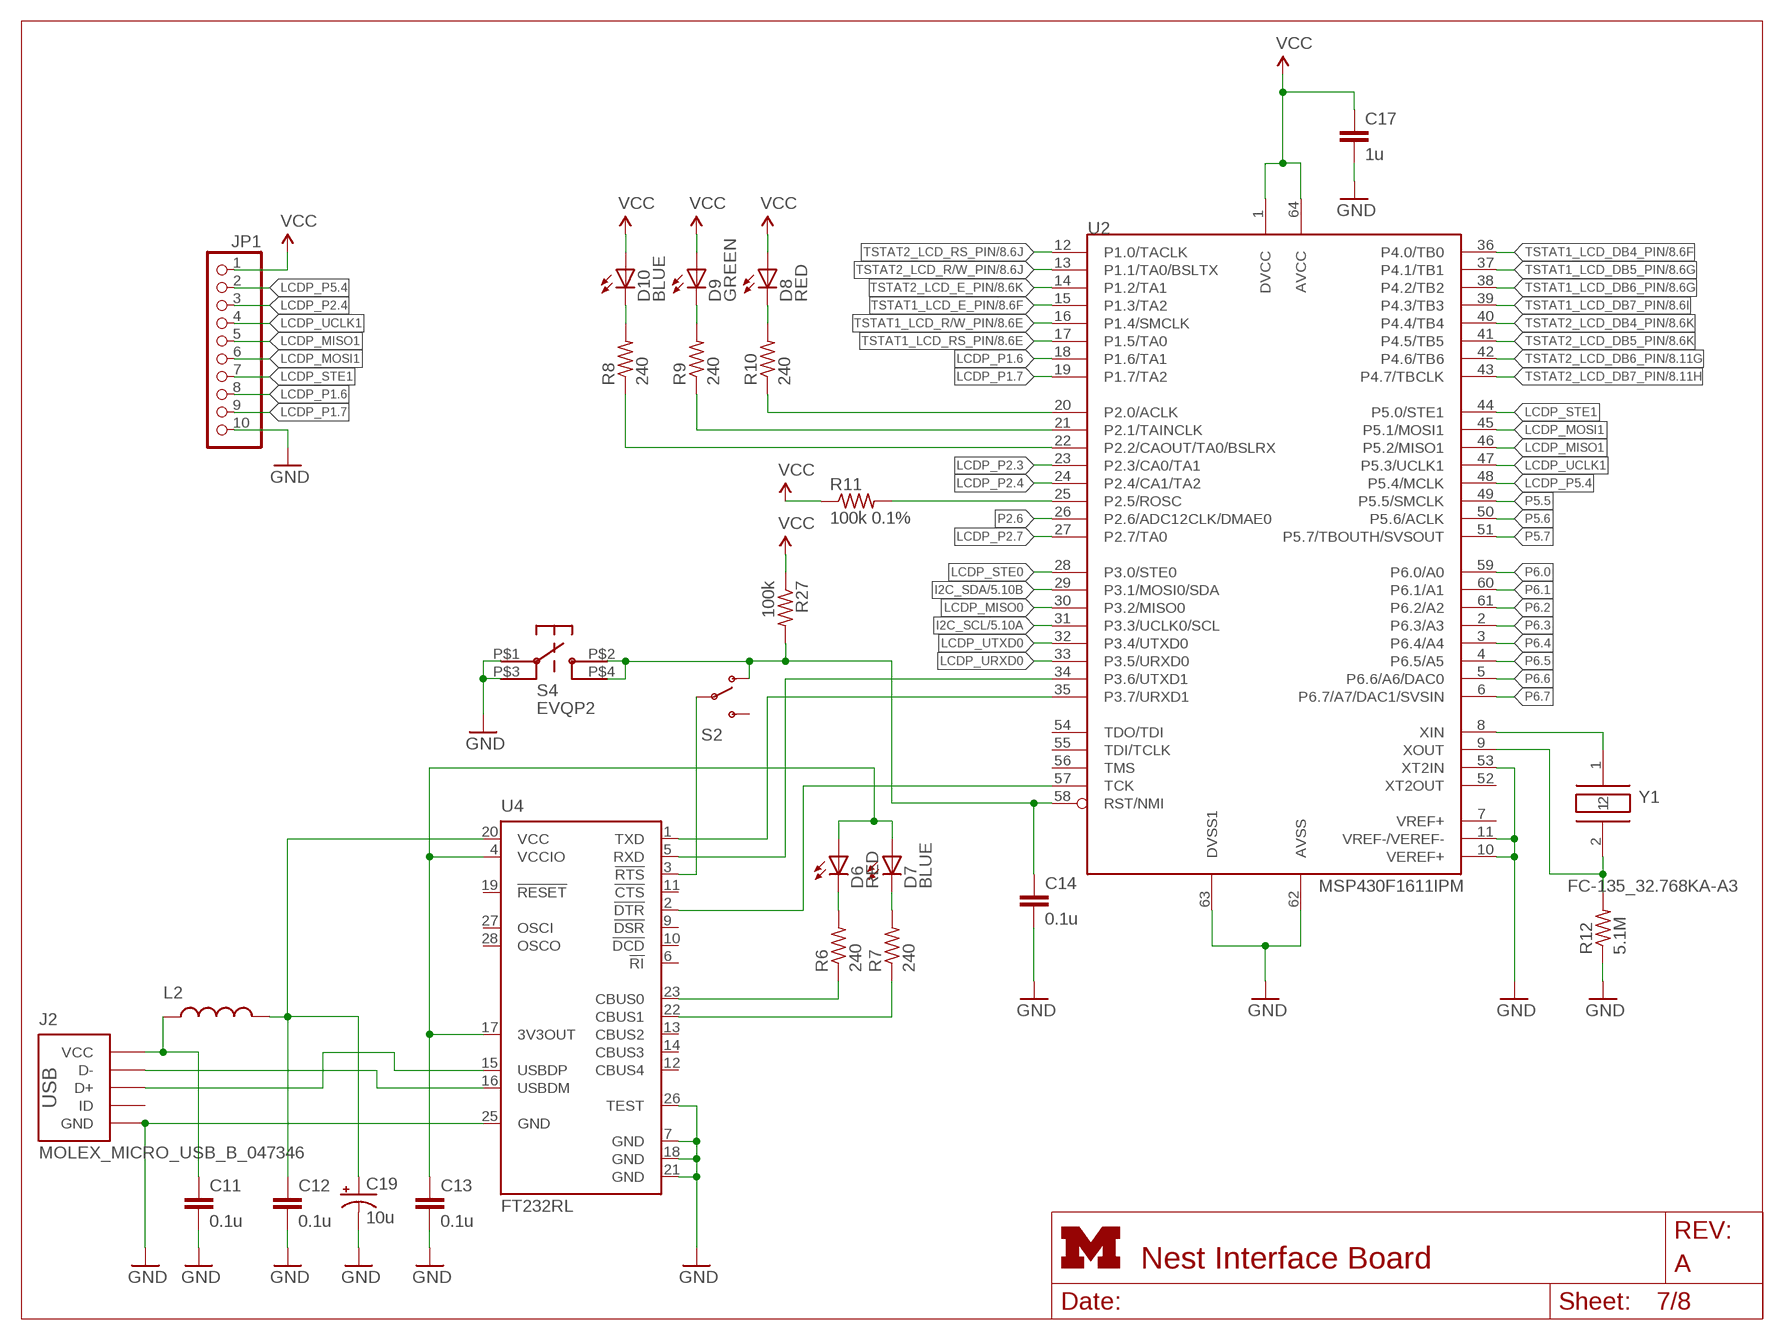
[diagram p6: schematic, sheet 7]

### Parts
C11  0.1u  C-EUC0603  [C0603]
C12  0.1u  C-EUC0603  [C0603]
C13  0.1u  C-EUC0603  [C0603]
C14  0.1u  C-EUC0603  [C0603]
C17  1u  C-EUC0603  [C0603]
C19  10u  CAP_POL1206  [EIA3216]
D6  RED  LED0603  [LED-0603]
D7  BLUE  LED0603  [LED-0603]
D8  RED  LED0603  [LED-0603]
D9  GREEN  LED0603  [LED-0603]
D10  BLUE  LED0603  [LED-0603]
J2  MOLEX_MICRO_USB_B_047346  [MOLEX_MICRO_USB_B_047346]
JP1  PINHD-1X10  [1X10]
L2  INDUCTOR0603  [0603]
R6  240  R-US_R0603  [R0603]
R7  240  R-US_R0603  [R0603]
R8  240  R-US_R0603  [R0603]
R9  240  R-US_R0603  [R0603]
R10  240  R-US_R0603  [R0603]
R11  100k 0.1%  R-US_R0603  [R0603]
R12  5.1M  R-US_R0603  [R0603]
R27  100k  R-US_R0603  [R0603]
S2  SWITCH-SPSTPTH  [SWITCH-SPDT]
S4  EVQP2  [EVQP2]
U2  MSP430F1611IPM  [PM/PAG64]
U4  FT232RL  [SSOP28]
Y1  FC-135_32.768KA-A3  [FC-135]

### Nets
GND: C11.2 C12.2 C13.2 C14.2 C17.2 C19.C(-) J2.GND JP1.10 R12.1 S4.P$1 S4.P$3 U2.10(VEREF+) U2.11(VREF-/VEREF-) U2.53(XT2IN) U2.62(AVSS) U2.63(DVSS1) U4.7(GND) U4.18(GND) U4.21(GND) U4.25(GND) U4.26(TEST) ; also sheet 1,2,3,4,5,6,8
I2C_SCL: U2.31(P3.3/UCLK0/SCL) ; also sheet 5,6
I2C_SDA: U2.29(P3.1/MOSI0/SDA) ; also sheet 5,6
LCDP_MISO0: U2.30(P3.2/MISO0)
LCDP_MISO1: JP1.5 U2.46(P5.2/MISO1)
LCDP_MOSI1: JP1.6 U2.45(P5.1/MOSI1)
LCDP_P1.6: JP1.8 U2.18(P1.6/TA1)
LCDP_P1.7: JP1.9 U2.19(P1.7/TA2)
LCDP_P2.3: U2.23(P2.3/CA0/TA1)
LCDP_P2.4: JP1.3 U2.24(P2.4/CA1/TA2)
LCDP_P2.7: U2.27(P2.7/TA0)
LCDP_P5.4: JP1.2 U2.48(P5.4/MCLK)
LCDP_STE0: U2.28(P3.0/STE0)
LCDP_STE1: JP1.7 U2.44(P5.0/STE1)
LCDP_UCLK1: JP1.4 U2.47(P5.3/UCLK1)
LCDP_URXD0: U2.33(P3.5/URXD0)
LCDP_UTXD0: U2.32(P3.4/UTXD0)
N$8: R10.1 U2.20(P2.0/ACLK)
N$13: D8.C R10.2
N$38: U2.8(XIN) Y1.1
N$39: C11.1 J2.VCC L2.1
N$40: J2.D- U4.16(USBDM)
N$41: J2.D+ U4.15(USBDP)
N$43: C12.1 C19.A(+) L2.2 U4.20(VCC)
N$44: R6.1 U4.23(CBUS0)
N$45: R7.1 U4.22(CBUS1)
N$46: D6.C R6.2
N$47: D7.C R7.2
N$48: U2.35(P3.7/URXD1) U4.1(TXD)
N$49: U2.34(P3.6/UTXD1) U4.5(RXD)
N$50: U2.57(TCK) U4.2(!DTR)
N$51: C13.1 D6.A D7.A U4.4(VCCIO) U4.17(3V3OUT)
N$52: R12.2 U2.9(XOUT) Y1.2
N$53: D9.C R9.2
N$54: R11.2 U2.25(P2.5/ROSC)
N$55: D10.C R8.2
N$56: R9.1 U2.21(P2.1/TAINCLK)
N$57: R8.1 U2.22(P2.2/CAOUT/TA0/BSLRX)
P2.6: U2.26(P2.6/ADC12CLK/DMAE0)
P5.5: U2.49(P5.5/SMCLK)
P5.6: U2.50(P5.6/ACLK)
P5.7: U2.51(P5.7/TBOUTH/SVSOUT)
P6.0: U2.59(P6.0/A0)
P6.1: U2.60(P6.1/A1)
P6.2: U2.61(P6.2/A2)
P6.3: U2.2(P6.3/A3)
P6.4: U2.3(P6.4/A4)
P6.5: U2.4(P6.5/A5)
P6.6: U2.5(P6.6/A6/DAC0)
P6.7: U2.6(P6.7/A7/DAC1/SVSIN)
RST1: C14.1 R27.2 S2.1(O) S4.P$2 S4.P$4 U2.58(RST/NMI)
RST_USB1: S2.2(P) U4.3(!RTS)
TSTAT1_LCD_DB4_PIN: U2.36(P4.0/TB0) ; also sheet 8
TSTAT1_LCD_DB5_PIN: U2.37(P4.1/TB1) ; also sheet 8
TSTAT1_LCD_DB6_PIN: U2.38(P4.2/TB2) ; also sheet 8
TSTAT1_LCD_DB7_PIN: U2.39(P4.3/TB3) ; also sheet 8
TSTAT1_LCD_E_PIN: U2.15(P1.3/TA2) ; also sheet 8
TSTAT1_LCD_R/W_PIN: U2.16(P1.4/SMCLK) ; also sheet 8
TSTAT1_LCD_RS_PIN: U2.17(P1.5/TA0) ; also sheet 8
TSTAT2_LCD_DB4_PIN: U2.40(P4.4/TB4) ; also sheet 8
TSTAT2_LCD_DB5_PIN: U2.41(P4.5/TB5) ; also sheet 8
TSTAT2_LCD_DB6_PIN: U2.42(P4.6/TB6) ; also sheet 8
TSTAT2_LCD_DB7_PIN: U2.43(P4.7/TBCLK) ; also sheet 8
TSTAT2_LCD_E_PIN: U2.14(P1.2/TA1) ; also sheet 8
TSTAT2_LCD_R/W_PIN: U2.13(P1.1/TA0/BSLTX) ; also sheet 8
TSTAT2_LCD_RS_PIN: U2.12(P1.0/TACLK) ; also sheet 8
VCC: C17.1 D8.A D9.A D10.A JP1.1 R11.1 R27.1 U2.1(DVCC) U2.64(AVCC) ; also sheet 1,2,4,5,6
Unconnected: J2.ID S2.3(S) U2.7(VREF+) U2.52(XT2OUT) U2.54(TDO/TDI) U2.55(TDI/TCLK) U2.56(TMS) U4.6(!RI) U4.9(!DSR) U4.10(!DCD) U4.11(!CTS) U4.12(CBUS4) U4.13(CBUS2) U4.14(CBUS3) U4.19(!RESET) U4.27(OSCI) U4.28(OSCO)

## Sheet 8 of 8: LCD I/O
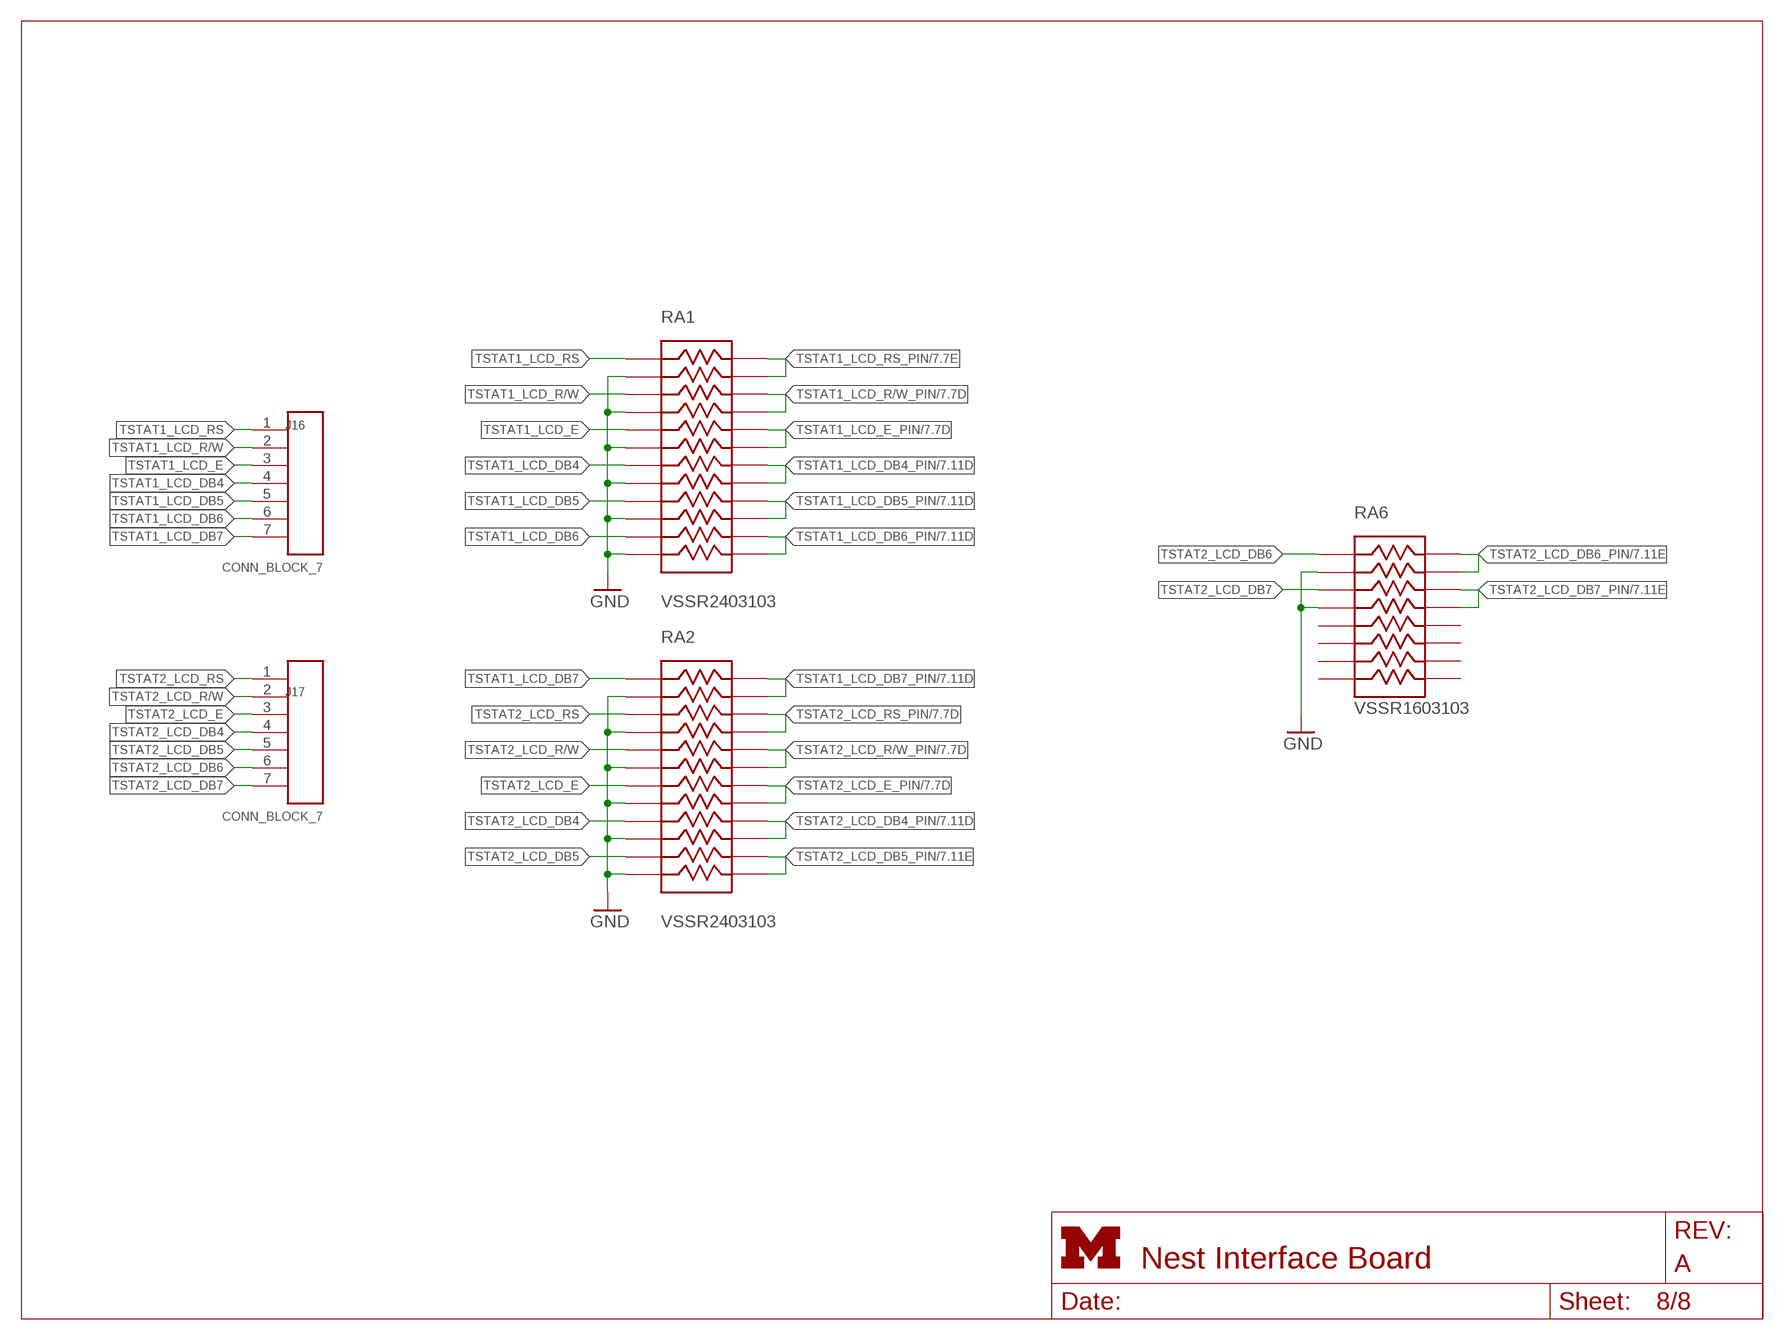
[diagram p7: schematic, sheet 8]

### Parts
J16  CONN_BLOCK_7  [CONN_BLOCK_7]
J17  CONN_BLOCK_7  [CONN_BLOCK_7]
RA1  VSSR2403103  [LSSOP-24]
RA2  VSSR2403103  [LSSOP-24]
RA6  VSSR1603103  [LSSOP-16]

### Nets
GND: RA1.2 RA1.4 RA1.6 RA1.8 RA1.10 RA1.12 RA2.2 RA2.4 RA2.6 RA2.8 RA2.10 RA2.12 RA6.2 RA6.4 ; also sheet 1,2,3,4,5,6,7
TSTAT1_LCD_DB4: J16.4 RA1.7
TSTAT1_LCD_DB4_PIN: RA1.17 RA1.18 ; also sheet 7
TSTAT1_LCD_DB5: J16.5 RA1.9
TSTAT1_LCD_DB5_PIN: RA1.15 RA1.16 ; also sheet 7
TSTAT1_LCD_DB6: J16.6 RA1.11
TSTAT1_LCD_DB6_PIN: RA1.13 RA1.14 ; also sheet 7
TSTAT1_LCD_DB7: J16.7 RA2.1
TSTAT1_LCD_DB7_PIN: RA2.23 RA2.24 ; also sheet 7
TSTAT1_LCD_E: J16.3 RA1.5
TSTAT1_LCD_E_PIN: RA1.19 RA1.20 ; also sheet 7
TSTAT1_LCD_R/W: J16.2 RA1.3
TSTAT1_LCD_R/W_PIN: RA1.21 RA1.22 ; also sheet 7
TSTAT1_LCD_RS: J16.1 RA1.1
TSTAT1_LCD_RS_PIN: RA1.23 RA1.24 ; also sheet 7
TSTAT2_LCD_DB4: J17.4 RA2.9
TSTAT2_LCD_DB4_PIN: RA2.15 RA2.16 ; also sheet 7
TSTAT2_LCD_DB5: J17.5 RA2.11
TSTAT2_LCD_DB5_PIN: RA2.13 RA2.14 ; also sheet 7
TSTAT2_LCD_DB6: J17.6 RA6.1
TSTAT2_LCD_DB6_PIN: RA6.15 RA6.16 ; also sheet 7
TSTAT2_LCD_DB7: J17.7 RA6.3
TSTAT2_LCD_DB7_PIN: RA6.13 RA6.14 ; also sheet 7
TSTAT2_LCD_E: J17.3 RA2.7
TSTAT2_LCD_E_PIN: RA2.17 RA2.18 ; also sheet 7
TSTAT2_LCD_R/W: J17.2 RA2.5
TSTAT2_LCD_R/W_PIN: RA2.19 RA2.20 ; also sheet 7
TSTAT2_LCD_RS: J17.1 RA2.3
TSTAT2_LCD_RS_PIN: RA2.21 RA2.22 ; also sheet 7
Unconnected: RA6.5 RA6.6 RA6.7 RA6.8 RA6.9 RA6.10 RA6.11 RA6.12

## Library data of the parts
C1-C17 = rcl:C-EU: CAPACITOR, European symbol
C18 C19 = SparkFun:CAP_POL: Capacitor Polarized These are standard SMD and PTH capacitors. Normally 10uF, 47uF, and 100uF in electrolytic and tantalum varieties. Always verify the external diameter of the through hole cap, it varies with capacity, voltage, and manufacturer. The EIA devices should be standard.; DIGIKEY: 478-1655-1-ND
D1-D10 = SparkFun:LED: LEDs Standard schematic elements and footprints for 5mm, 3mm, 1206, and 0603 sized LEDs. 5mm - Spark Fun Electronics SKU : COM-00529 (and others)
D11-D24 = nest_interface:B5818WS-SCHOTTKY-DIODE; DIGIKEY: B5818WS-TPMSCT-ND
J1 J2 = nest_interface:MOLEX_MICRO_USB_B_047346: Very tiny smd micro USB receptacle.; DIGIKEY: WM17141CT-ND
J3 = pinhead:PINHD-2X10: PIN HEADER
J5 = nest_interface:PJ-036A-SMT: CONN PWR JACK 2.0X6.3MM SMT; DIGIKEY: CP-036APJCT-ND
J6-J13 = nest_interface:CONN_BLOCK_2: 2x 0.100 in screw terminal block; DIGIKEY: 277-1273-ND
J14 J15 = nest_interface:CONN_BLOCK_3: 3x 0.100 in screw terminal block; DIGIKEY: 277-1274-ND
J16 J17 = nest_interface:CONN_BLOCK_7: 7x 0.100 in screw terminal block; DIGIKEY: 277-1278-ND
J18-J21 = nest_interface:CONN_BLOCK_8: 8x 0.100 in screw terminal block; DIGIKEY: 277-1279-ND
JP1 = pinhead:PINHD-1X10: PIN HEADER
L1 L2 = SparkFun:INDUCTOR: Inductors Basic Inductor/Choke - 0603 and 1206. Footprints are not proven and vary greatly between part numbers.; DIGIKEY: 240-2373-1-ND
Q1 Q2 = nest_interface:TRANSISTOR_NPN: Transistor NPN BJT configuration in SOT23 package. MMBT2222 is the common NPN we use. Double check BCE configuration again layout.; DIGIKEY: 568-1636-1-ND
QA1-QA3 = nest_interface:MMPQ2222A: 4 npn transistor array; DIGIKEY: MMPQ2222ACT-ND
R1-R27 = rcl:R-US_: RESISTOR, American symbol
RA1-RA3 = nest_interface:VSSR2403103: 12x 10k resistor array; DIGIKEY: VSSR24-10K-JI-ND
RA4 = nest_interface:766161104GP: 15x 100k resistor array bussed; DIGIKEY: 766-161-R100KP-ND
RA6 = nest_interface:VSSR1603103: RES ARRAY 10K OHM 8 RES 16-LSSOP; DIGIKEY: VSSR16-10K-JI-ND
RE1-RE6 = nest_interface:RT314524: RELAY GEN PURPOSE SPDT 16A 24VAC; DIGIKEY: PB1238-ND
S1 S2 = SparkFun:SWITCH-SPST: SPST Switch Simple slide switch. Spark Fun Electronics SKU : COM-00102; DIGIKEY: EG1903-ND
S3 S4 = berkeley-epic:EVQP2; DIGIKEY: P11084SCT-ND
SA1-SA4 = nest_interface:TS12A44515DR; DIGIKEY: 296-24790-1-ND
U1 = berkeley-epic:EPIC-CORE_A
U2 = hijack:MSP430F1611
U3 U4 = ftdichip:FT232R: Source: http://www.ftdichip.com/Documents/DataSheets/DS_FT232R_v104.pdf; DIGIKEY: 768-1007-1-ND; MPN: FT232RL; OC_FARNELL: 1146032; OC_NEWARK: 91K9918
U5 = nest_interface:MPC1825: 3V 500mA LDO; DIGIKEY: MCP1825S-3002E/DB-ND
U6 = nest_interface:TC1262: 5V 500mA LDO; DIGIKEY: TC1262-5.0VDB-ND
U7 U8 = nest_interface:PCA9575: 16 channel I2C GPIO module.; DIGIKEY: 568-6647-1-ND
U$1 = nest_interface:UMICH_SOLID
Y1 = berkeley-epic:FC-135_32.768KA-A3; DIGIKEY: 535-9543-1-ND